# EAGLE schematic JLink MCU flash cable (EAGLE 7.6.0)
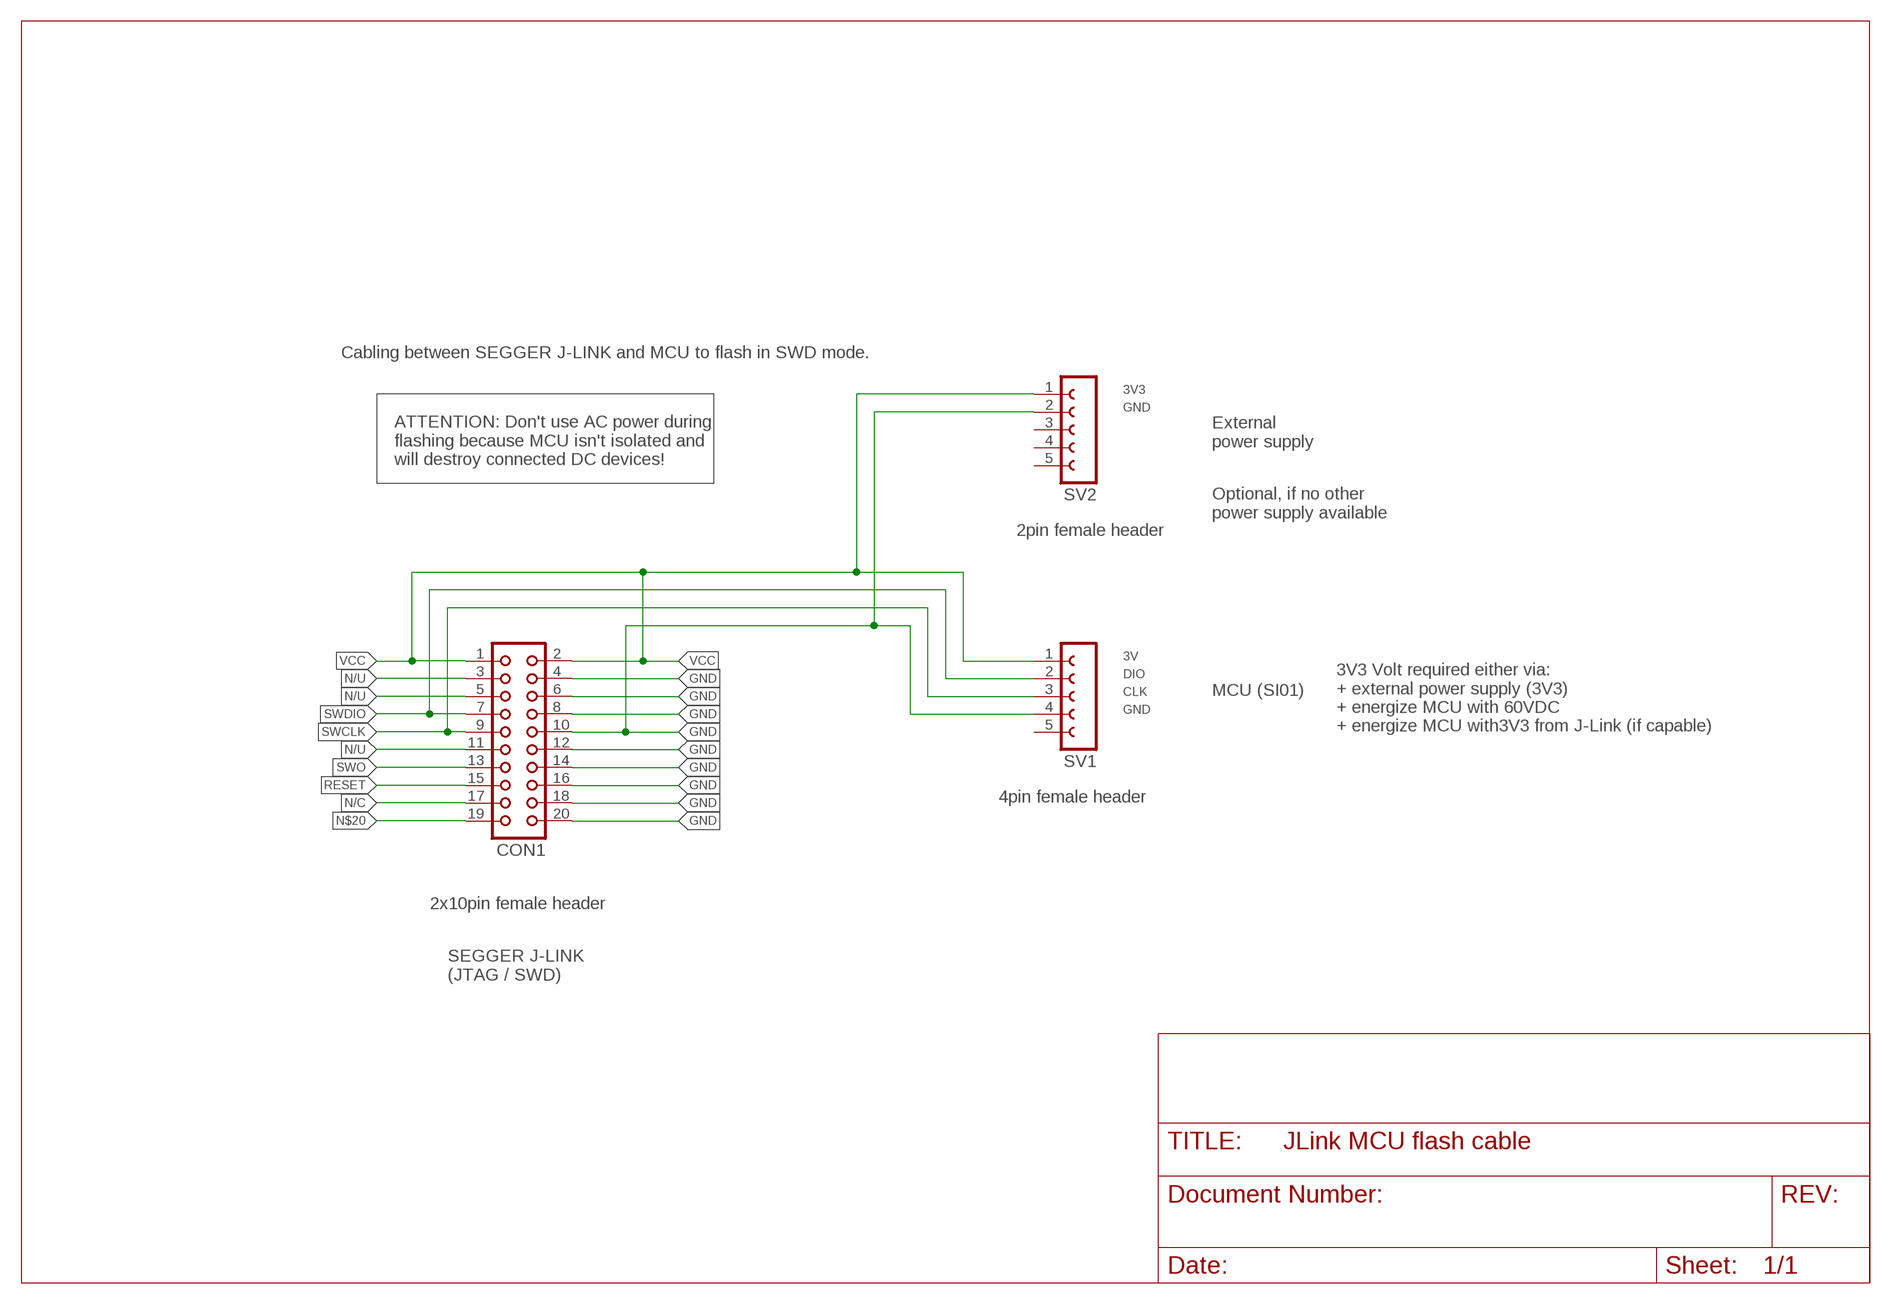
[diagram p0: schematic, sheet 1]

## Parts
CON1  CON20  [CON20]
SV1  FE05-1  [FE05-1]
SV2  FE05-1  [FE05-1]

## Nets
GND: CON1.4 CON1.6 CON1.8 CON1.10 CON1.12 CON1.14 CON1.16 CON1.18 CON1.20 SV1.4 SV2.2
N$20: CON1.19
N/C: CON1.17
N/U: CON1.3 CON1.5 CON1.11
RESET: CON1.15
SWCLK: CON1.9 SV1.3
SWDIO: CON1.7 SV1.2
SWO: CON1.13
VCC: CON1.1 CON1.2 SV1.1 SV2.1
Unconnected: SV1.5 SV2.3 SV2.4 SV2.5

## Notes on the sheet
- Cabling between SEGGER J-LINK and MCU to flash in SWD mode.
- 3V3
- GND
- External
  power supply
- ATTENTION: Don't use AC power during
  flashing because MCU isn't isolated and
  will destroy connected DC devices!
- Optional, if no other 
  power supply available
- 2pin female header
- 3V
- DIO
- CLK | MCU (SI01)
- GND
- 3V3 Volt required either via:
  + external power supply (3V3)
  + energize MCU with 60VDC
  + energize MCU with3V3 from J-Link (if capable)
- 4pin female header
- 2x10pin female header
- SEGGER J-LINK
  (JTAG / SWD)

## Library data of the parts
CON1 = con-harting:CON20: CONNECTOR; OC_FARNELL: unknown; OC_NEWARK: unknown
SV1 SV2 = con-lsta:FE05-1: FEMALE HEADER; OC_FARNELL: unknown; OC_NEWARK: unknown